# EAGLE design #100042155.3 (EAGLE 6.5.0)
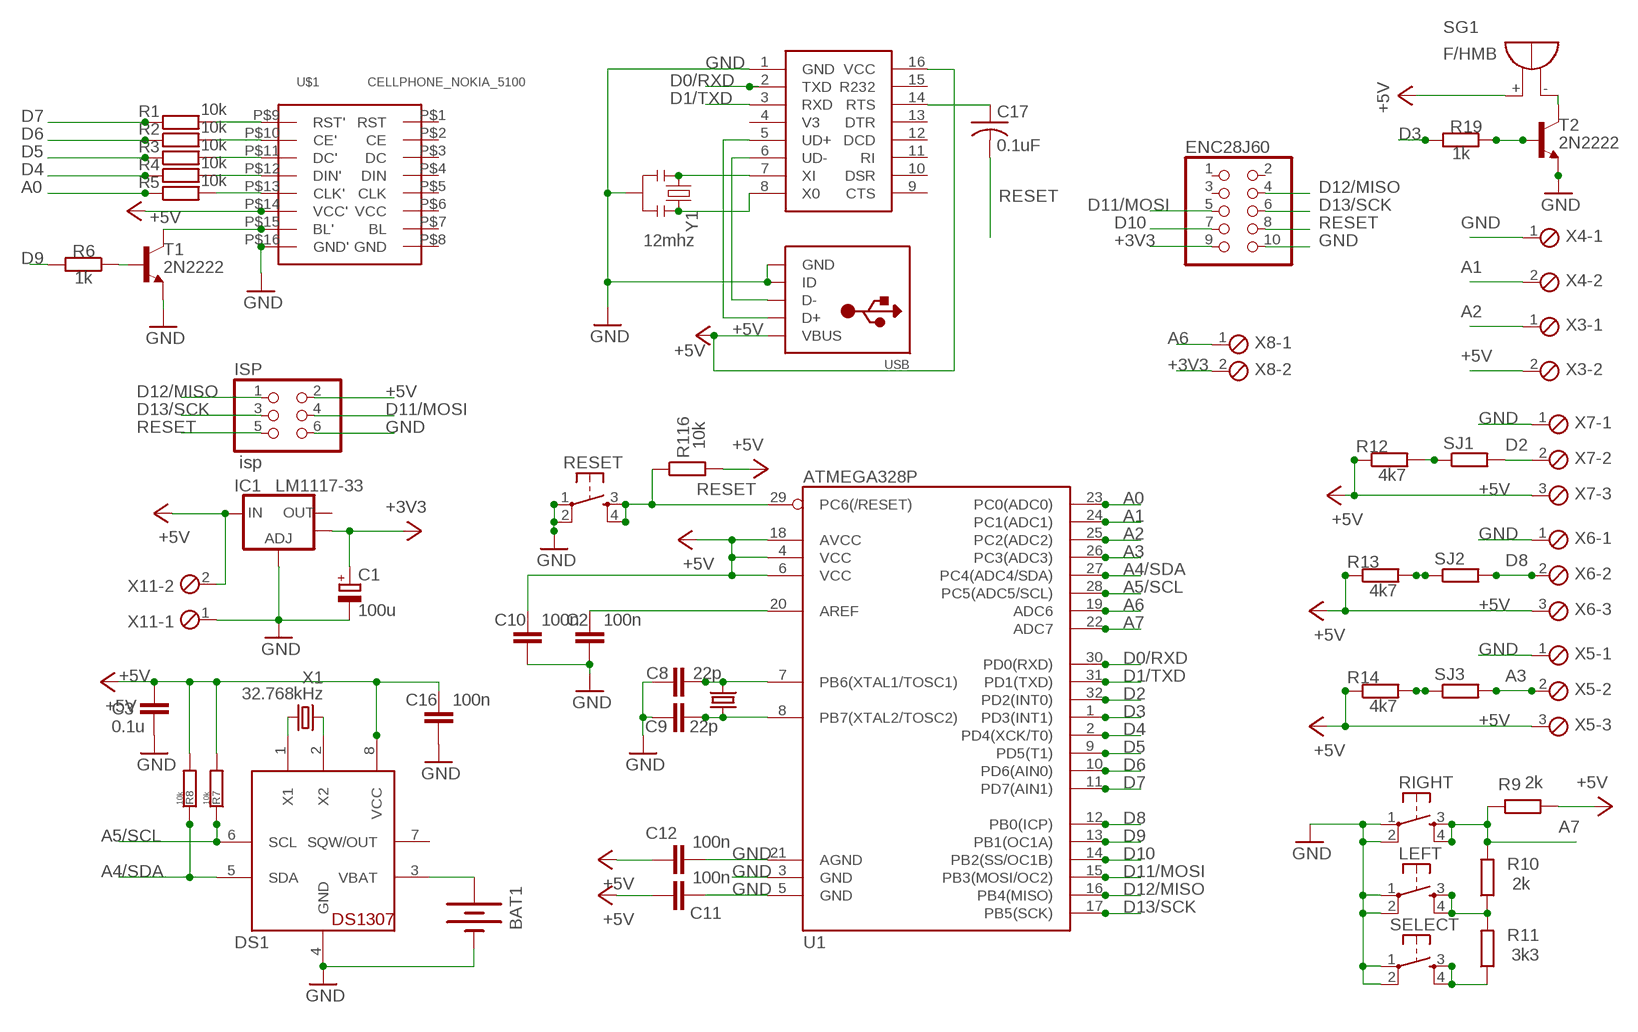
[diagram p0: schematic, sheet 1]

## Parts
BAT1  BATTERY20PTH  [BATTCOM_20MM_PTH]
C1  100u  CPOL-EUE2-5  [E2-5]
C2  100n  C-EUC0805  [C0805]
C3  0.1u  C-EUC0805  [C0805]
C8  22p  C-EUC0805  [C0805]
C9  22p  C-EUC0805  [C0805]
C10  100n  C-EUC0805  [C0805]
C11  100n  C-EUC0805  [C0805]
C12  100n  C-EUC0805  [C0805]
C16  100n  C-EUC0805  [C0805]
C17  0.1uF  C-USC0805K  [C0805K]
DS1  DS1307  DS1307SOIC  [SO08]
ENC28J60  PINHD-2X5  [2X05]
IC1  LM1117-33  V_REG_LM1117SOT223  [SOT223]
ISP  isp  PINHD-2X3  [2X03]
LEFT  TAC_SWITCHPTH  [TACTILE-PTH]
R1  10k  R-EU_R0805  [R0805]
R2  10k  R-EU_R0805  [R0805]
R3  10k  R-EU_R0805  [R0805]
R4  10k  R-EU_R0805  [R0805]
R5  10k  R-EU_R0805  [R0805]
R6  1k  R-EU_R0805  [R0805]
R7  10k  R-EU_R0805  [R0805]
R8  10k  R-EU_R0805  [R0805]
R9  2k  R-EU_R0805  [R0805]
R10  2k  R-EU_R0805  [R0805]
R11  3k3  R-EU_R0805  [R0805]
R12  4k7  R-EU_R0805  [R0805]
R13  4k7  R-EU_R0805  [R0805]
R14  4k7  R-EU_R0805  [R0805]
R19  1k  R-EU_R0805  [R0805]
R116  10k  R-EU_R0805  [R0805]
RESET  TAC_SWITCHPTH  [TACTILE-PTH]
RIGHT  TAC_SWITCHPTH  [TACTILE-PTH]
SELECT  TAC_SWITCHPTH  [TACTILE-PTH]
SG1  F/HMB  [F/HMB]
SJ1  R-EU_R0402  [R0402]
SJ2  R-EU_R0402  [R0402]
SJ3  R-EU_R0402  [R0402]
T1  2N2222  [TO92-EBC-OVAL]
T2  2N2222  [TO92-EBC-OVAL]
U1  ATMEGA328P  ATMEGA328_SMT  [TQFP32-08]
U$1  CELLPHONE_NOKIA_5100  [CELLPHONE_NOKIA_5100_SPARKFUN]
U$2  CH340G  [SO016]
USB  USBMOLEX  [USB-MINIB-THM-MOLEX]
X1  32.768kHz  CRYSTALTC26H  [TC26H]
X2  16MHz  CRYSTALHC49US  [HC49US]
X3  MPT2  [2POL254]
X4  MPT2  [2POL254]
X5  MPT3  [3POL254]
X6  MPT3  [3POL254]
X7  MPT3  [3POL254]
X8  MPT2  [2POL254]
X11  MPT2  [2POL254]
Y1  12mhz  RESONATORPTH  [RESONATOR-PTH]

## Nets
+3V3: C1.+ ENC28J60.9 IC1.4(OUT) X8.2
+5V: C3.1 C10.1 C11.2 C12.2 C16.1 DS1.8(VCC) IC1.3(IN) ISP.2 R7.2 R8.2 R9.2 R12.1 R13.1 R14.1 R116.2 SG1.+ U1.4(VCC) U1.6(VCC) U1.18(AVCC) U$1.P$14(VCC') U$2.16(VCC) USB.VBUS X3.2 X5.3 X6.3 X7.3 X11.2
A0: R5.1 U1.23(PC0(ADC0))
A1: U1.24(PC1(ADC1)) X4.2
A2: U1.25(PC2(ADC2)) X3.1
A3: SJ3.2 U1.26(PC3(ADC3)) X5.2
A4/SDA: DS1.5(SDA) R8.1 U1.27(PC4(ADC4/SDA))
A5/SCL: DS1.6(SCL) R7.1 U1.28(PC5(ADC5/SCL))
A6: U1.19(ADC6) X8.1
A7: R9.1 R10.2 RIGHT.3 RIGHT.4 U1.22(ADC7)
AREF: C2.1 U1.20(AREF)
D0/RXD: U1.30(PD0(RXD)) U$2.2(TXD)
D1/TXD: U1.31(PD1(TXD)) U$2.3(RXD)
D2: SJ1.2 U1.32(PD2(INT0)) X7.2
D3: R19.2 U1.1(PD3(INT1))
D4: R4.1 U1.2(PD4(XCK/T0))
D5: R3.1 U1.9(PD5(T1))
D6: R2.1 U1.10(PD6(AIN0))
D7: R1.1 U1.11(PD7(AIN1))
D8: SJ2.2 U1.12(PB0(ICP)) X6.2
D9: R6.2 U1.13(PB1(OC1A))
D10: ENC28J60.7 U1.14(PB2(SS/OC1B))
D11/MOSI: ENC28J60.5 ISP.4 U1.15(PB3(MOSI/OC2))
D12/MISO: ENC28J60.4 ISP.1 U1.16(PB4(MISO))
D13/SCK: ENC28J60.6 ISP.3 U1.17(PB5(SCK))
GND: BAT1.2(-) C1.- C2.2 C3.2 C8.1 C9.1 C10.2 C11.1 C12.1 C16.2 DS1.4(GND) ENC28J60.10 IC1.1(ADJ) ISP.6 LEFT.1 LEFT.2 RESET.1 RESET.2 RIGHT.1 RIGHT.2 SELECT.1 SELECT.2 T1.E T2.E U1.3(GND) U1.5(GND) U1.21(AGND) U$1.P$16(GND') U$2.1(GND) USB.GND USB.ID X4.1 X5.1 X6.1 X7.1 X11.1 Y1.2
N$1: LEFT.3 LEFT.4 R10.1 R11.2
N$2: R5.2 U$1.P$13(CLK')
N$3: R4.2 U$1.P$12(DIN')
N$4: R3.2 U$1.P$11(DC')
N$5: R2.2 U$1.P$10(CE')
N$6: R1.2 U$1.P$9(RST')
N$7: BAT1.1(+) DS1.3(VBAT)
N$8: DS1.1(X1) X1.2
N$10: U$2.7(XI) Y1.1
N$11: U$2.6(UD-) USB.D-
N$15: U$2.5(UD+) USB.D+
N$17: R13.2 SJ2.1
N$18: R11.1 SELECT.3 SELECT.4
N$26 [signal]: T1.C U$1.P$15(BL')
N$27: R19.1 T2.B
N$28: R14.2 SJ3.1
N$29: SG1.- T2.C
N$30: DS1.2(X2) X1.1
N$31: R12.2 SJ1.1
N$32: C9.2 U1.8(PB7(XTAL2/TOSC2)) X2.1
N$33: C8.2 U1.7(PB6(XTAL1/TOSC1)) X2.2
N$40: U$2.8(X0) Y1.3
N$43: C17.1 U$2.14(RTS)
N$44: R6.1 T1.B
RESET: C17.2 ENC28J60.8 ISP.5 R116.1 RESET.3 RESET.4 U1.29(PC6(/RESET))
Unconnected: DS1.7(SQW/OUT) ENC28J60.1 ENC28J60.2 ENC28J60.3 IC1.2(OUT) U$1.P$1(RST) U$1.P$2(CE) U$1.P$3(DC) U$1.P$4(DIN) U$1.P$5(CLK) U$1.P$6(VCC) U$1.P$7(BL) U$1.P$8(GND) U$2.4(V3) U$2.9(CTS) U$2.10(DSR) U$2.11(RI) U$2.12(DCD) U$2.13(DTR) U$2.15(R232)

## Library data of the parts
BAT1 = SparkFun-Electromechanical:BATTERY: Battery Holders Various common sizes : AA, AAA, 20mm coin cell and 12mm coin cell. 20MM_4LEGS, BATT-10373
C1 = resistor:CPOL-EU: POLARIZED CAPACITOR, European symbol
C2 C8-C12 C16 = resistor:C-EU: CAPACITOR, European symbol
C3 = rcl:C-EU: CAPACITOR, European symbol
C17 = rcl:C-US: CAPACITOR, American symbol
DS1 = adafruit:DS1307: DS1307 Real time clock (RTC) with battery backup ability. Talk to it via i2c
ENC28J60 = pinhead:PINHD-2X5: PIN HEADER
IC1 = SparkFun:V_REG_LM1117: Voltage Regulator LM1117 Standard adjustable voltage regulator but in SMD form. Spark Fun Electronics SKU : COM-00595
ISP = pinhead:PINHD-2X3: PIN HEADER
LEFT RESET RIGHT SELECT = SparkFun-Electromechanical:TAC_SWITCH: Momentary Switch Button commonly used for reset or general input. Spark Fun Electronics SKU : COM-00097 SMT- SWCH-08247
R1-R14 R19 R116 SJ1-SJ3 = rcl:R-EU_: RESISTOR, European symbol
SG1 = buzzer:F/HMB: BUZZER Source: Buerklin; OC_FARNELL: unknown; OC_NEWARK: unknown
T1 T2 = adafruit:2N2222: NPN TRANSISTOR Big oval pads
U1 = SparkFun-DigitalIC:ATMEGA328_SMT: 32-Pin Atmega328 part Commonly used on Arduino compatible boards Available in QFP and QFN packages TQFP is IC-09069 QFN is non-stock; PROD_ID: IC-09069
U$1 = DIY-Cellphone:CELLPHONE_NOKIA_5100
U$2 = ch340:CH340G: CH340G
USB = adafruit:USB: USB Connectors USBMINIB - Surface Mount Female Mini-B USB Connector 4UConnector: 06564 By microbuilder.eu Thru-hole RA Female Mini-B USB Connector 4UConnector: 18732 By ladyada.net
X1 = crystal:CRYSTAL: CRYSTAL; OC_FARNELL: unknown; OC_NEWARK: unknown
X2 = SparkFun:CRYSTAL: Crystals Various standard crystals. Proven footprints. Spark Fun Electronics SKU : COM-00534
X3 X4 X8 X11 = con-phoenix-254:MPT2: PHOENIX CONNECTOR; OC_FARNELL: unknown; OC_NEWARK: unknown
X5-X7 = con-phoenix-254:MPT3: PHOENIX CONNECTOR; OC_FARNELL: unknown; OC_NEWARK: unknown
Y1 = SparkFun-FreqCtrl:RESONATOR: Resonator Small SMD resonator. Used, eg, on the Arduino Pro/ Pro Mini boards. 8MHz- XTAL-08895 16MHz- XTAL-08900

## Net classes
0 default: width 0.178 mm, clearance 0.205 mm
1 power: width 0.203 mm, clearance 0.203 mm
2 GND: width 0.203 mm
3 signal: width 0.178 mm, clearance 0.205 mm to class 0, clearance 0.205 mm to class 1, clearance 0.205 mm to class 2, clearance 0.205 mm

## Board
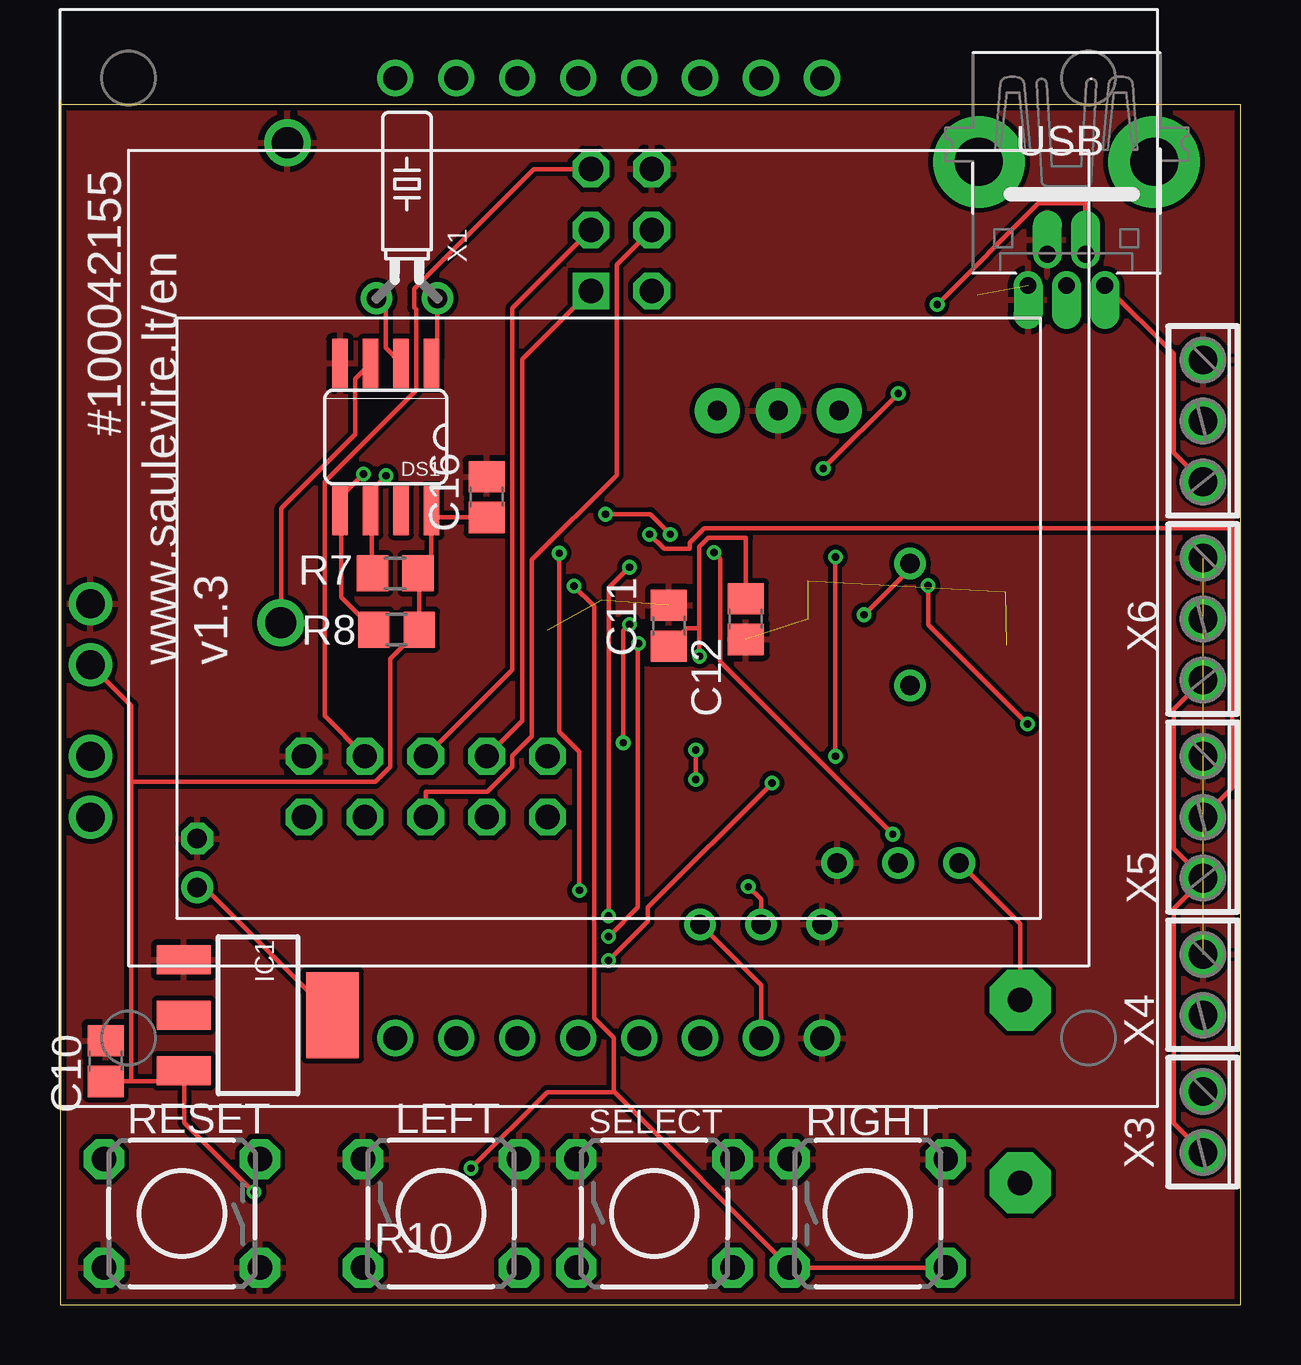
[diagram p1: board, top side]
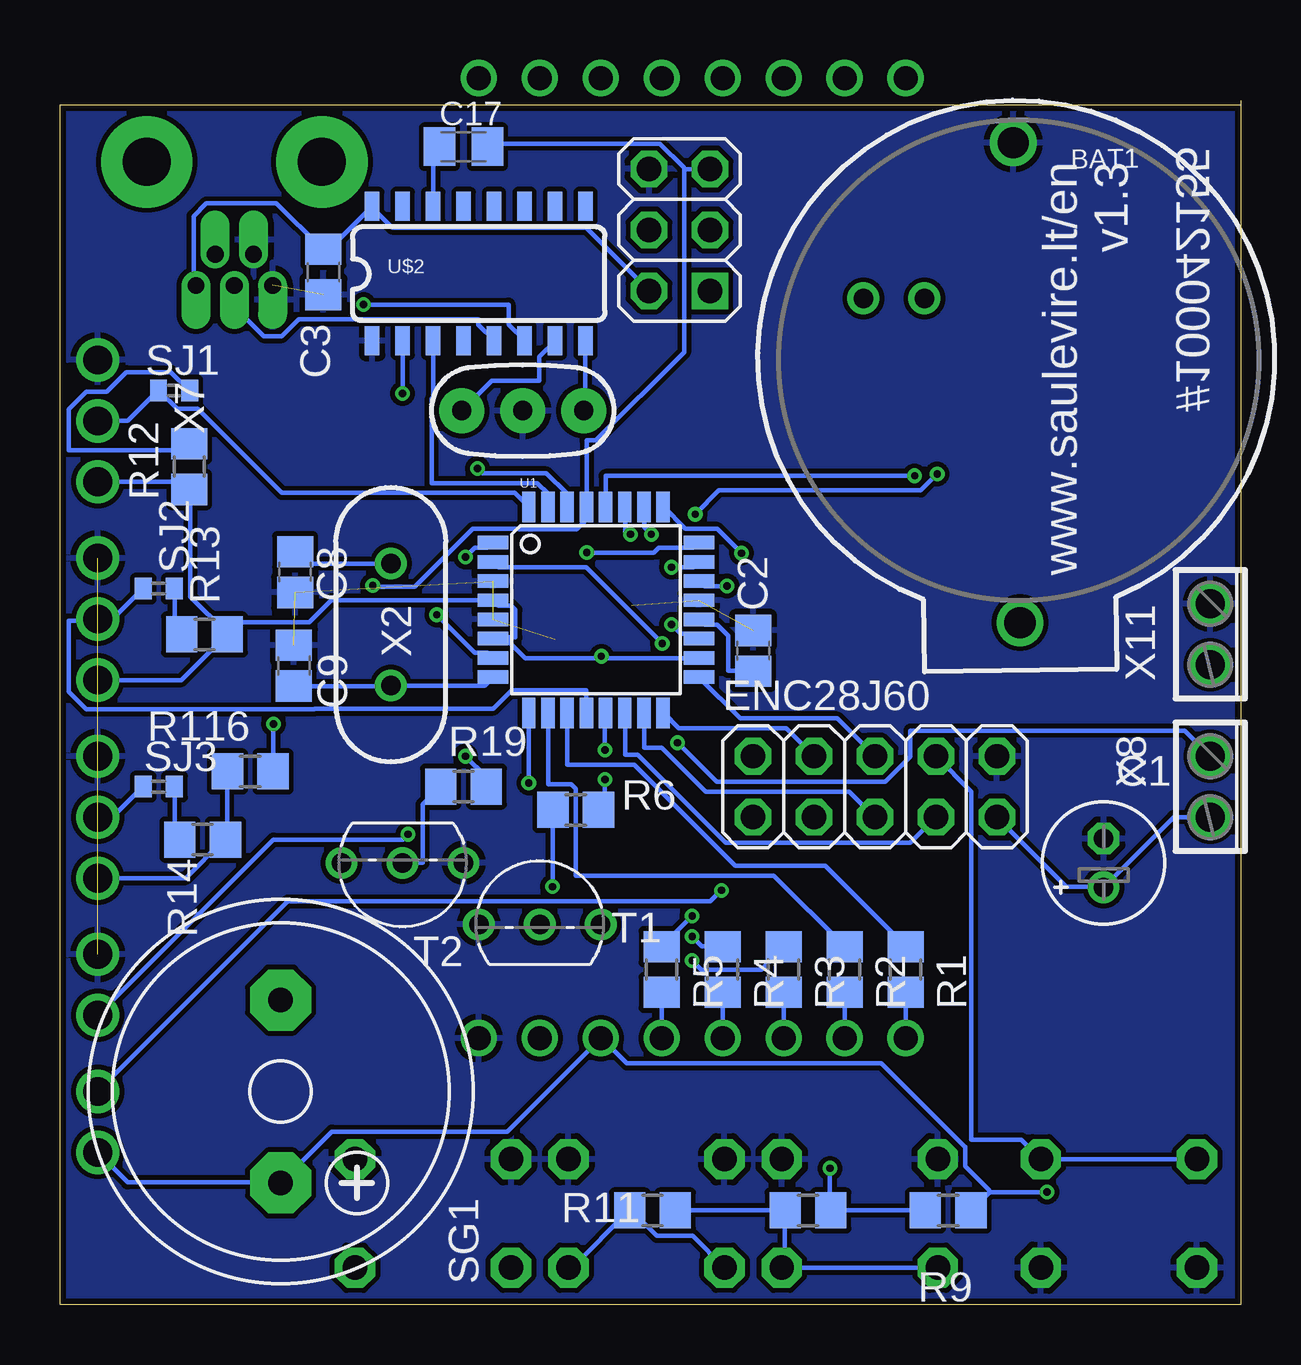
[diagram p2: board, bottom side, seen from below]

Size 49.2 x 50.16 mm. Coordinates in mm from the lower left corner, seen from the top.
Outline: 0,50 49.2,50 49.2,0 0,0 0,50.16
Copper layers (1*16): Top 0.035mm / dielectric 1.5mm / Bottom 0.035mm
Design rules "ITEADstudio_DRC": minimum track width 6mil, minimum drill 12mil, track to track 6mil, track to pad 6mil, pad to pad 6mil, via to via 6mil, smd to smd 0mil, copper to edge 10mil, drill to drill 10mil, minimum pad ring 10mil, minimum via ring 6mil, stop-mask expansion 2mil, vias tented up to drill 100mil, thermal gap 10mil
vRestrict: area 32,73 to 71,78

### Footprints (pad centres in the part's own frame; a part is rotated, then mirrored left to right if it is on the bottom)
BATTCOM_20MM_PTH = drill 1.3: 1 20,0; 2 0,0
E2-5 = drill 0.813 pad 1.27: + -1.016,0 | drill 0.813 pad 1.27 octagon: - 1.016,0
C0805 = smd 1.3 x 1.5: 1 -0.85,0; 2 0.85,0
C0805' = smd 1.3 x 1.5: 1 -0.95,0; 2 0.95,0
C0805K = smd 1.3 x 1.6: 1 -1,0; 2 1,0
SO08 = smd 0.66 x 2.032: 1 -1.905,-3.073; 2 -0.635,-3.073; 3 0.635,-3.073; 4 1.905,-3.073; 5 1.905,3.073; 6 0.635,3.073; 7 -0.635,3.073; 8 -1.905,3.073
2X05 = drill 1.016 octagon: 1 -5.08,-1.27; 2 -5.08,1.27; 3 -2.54,-1.27; 4 -2.54,1.27; 5 0,-1.27; 6 0,1.27; 7 2.54,-1.27; 8 2.54,1.27; 9 5.08,-1.27; 10 5.08,1.27
SOT223 = smd 1.219 x 2.235: 1 -2.311,-3.099; 2 0,-3.099; 3 2.311,-3.099 | smd 3.6 x 2.2: 4 0,3.099
2X03 = drill 1.016 square: 1 -2.54,-1.27 | drill 1.016 octagon: 2 -2.54,1.27; 3 0,-1.27; 4 0,1.27; 5 2.54,-1.27; 6 2.54,1.27
TACTILE-PTH = drill 1.016 pad 1.676 octagon: 1 -3.251,2.261; 2 3.251,2.261; 3 -3.251,-2.261; 4 3.251,-2.261
R0805 = smd 1.3 x 1.5: 1 -0.95,0; 2 0.95,0
F/HMB = drill 1.016 pad 2.54 octagon: + 3.81,0; - -3.81,0
R0402 = smd 0.7 x 0.9: 1 -0.65,0; 2 0.65,0
TO92-EBC-OVAL = drill 0.813: B 0,-1.27; C 2.54,-1.27; E -2.54,-1.27
TQFP32-08 = smd 1.27 x 0.559: 1 -4.293,2.8; 2 -4.293,2; 3 -4.293,1.2; 4 -4.293,0.4; 5 -4.293,-0.4; 6 -4.293,-1.2; 7 -4.293,-2; 8 -4.293,-2.8; 17 4.293,-2.8; 18 4.293,-2; 19 4.293,-1.2; 20 4.293,-0.4; 21 4.293,0.4; 22 4.293,1.2; 23 4.293,2; 24 4.293,2.8 | smd 0.559 x 1.27: 9 -2.8,-4.293; 10 -2,-4.293; 11 -1.2,-4.293; 12 -0.4,-4.293; 13 0.4,-4.293; 14 1.2,-4.293; 15 2,-4.293; 16 2.8,-4.293; 25 2.8,4.293; 26 2,4.293; 27 1.2,4.293; 28 0.4,4.293; 29 -0.4,4.293; 30 -1.2,4.293; 31 -2,4.293; 32 -2.8,4.293
CELLPHONE_NOKIA_5100_SPARKFUN = drill 1: P$1 -8.89,20; P$2 -6.35,20; P$3 -3.81,20; P$4 -1.27,20; P$5 1.27,20; P$6 3.81,20; P$7 6.35,20; P$8 8.89,20; P$9 -8.89,-20; P$10 -6.35,-20; P$11 -3.81,-20; P$12 -1.27,-20; P$13 1.27,-20; P$14 3.81,-20; P$15 6.35,-20; P$16 8.89,-20
SO016 = smd 0.6 x 1.2: 1 -4.445,-2.8; 2 -3.175,-2.8; 3 -1.905,-2.8; 4 -0.635,-2.8; 5 0.635,-2.8; 6 1.905,-2.8; 7 3.175,-2.8; 8 4.445,-2.8; 9 4.445,2.8; 10 3.175,2.8; 11 1.905,2.8; 12 0.635,2.8; 13 -0.635,2.8; 14 -1.905,2.8; 15 -3.175,2.8; 16 -4.445,2.8
USB-MINIB-THM-MOLEX = drill 0.7 offset: D+ 0,9.72; D- -0.8,8.42; GND 1.6,9.72; ID 0.8,8.42; VBUS -1.6,9.72 | drill 2 pad 3.81: GND1 -3.65,4.57; GND4 3.65,4.57
TC26H = drill 0.813: 1 -1.27,0; 2 1.27,0
HC49US = drill 0.813: 1 -2.54,0; 2 2.54,0
2POL254 = drill 1.2: 1 -1.27,0; 2 1.27,0
3POL254 = drill 1.2: 1 -2.54,0; 2 0,0; 3 2.54,0
RESONATOR-PTH = drill 0.8 pad 1.88: 1 -2.54,0; 2 0,0; 3 2.54,0

### Placement (x,y rotation side)
BAT1  9.48,48.42 270.8 bottom
C1  5.71,18.41 90 bottom
C2  20.32,27.25 90 bottom
C3  0.1u  [C0805']  38.22,43.04 270 bottom
C8  39.41,30.54 90 bottom
C9  39.45,26.64 270 bottom
C10  1.91,10.16 90 top
C11  25.37,28.3 270 top
C12  28.57,28.57 90 top
C16  17.78,33.66 90 top
C17  32.38,48.26 0 bottom
DS1  13.57,36.16 180 top
ENC28J60  15.24,21.59 0 bottom
IC1  8.26,12.06 270 top
ISP  23.39,44.79 90 bottom
LEFT  15.88,3.81 0 top
R1  13.97,13.97 270 bottom
R2  16.51,13.97 270 bottom
R3  19.05,13.97 270 bottom
R4  21.59,13.97 270 bottom
R5  24.13,13.97 270 bottom
R6  27.71,20.62 0 bottom
R7  13.97,30.48 0 top
R8  14.02,28.13 0 top
R9  12.19,3.94 0 bottom
R10  18.03,3.94 0 bottom
R11  24.51,3.94 0 bottom
R12  43.81,34.92 90 bottom
R13  43.18,27.94 180 bottom
R14  43.26,19.38 180 bottom
R19  32.38,21.59 0 bottom
R116  41.27,22.23 180 bottom
RESET  5.08,3.81 180 top
RIGHT  33.66,3.81 0 top
SELECT  24.77,3.81 0 top
SG1  40.01,8.89 270 bottom
SJ1  44.45,38.1 180 bottom
SJ2  45.09,29.84 180 bottom
SJ3  45.09,21.59 180 bottom
T1  29.21,17.12 0 bottom
T2  34.92,17.14 180 bottom
U1  26.87,28.96 0 bottom
U$1  22.86,31.11 0 top
U$2  31.75,42.98 0 bottom
USB  41.94,52.2 180 top
X1  14.46,41.94 0 top
X2  35.41,28.34 90 bottom
X3  47.62,7.62 270 top
X4  47.62,13.34 270 top
X5  47.62,20.32 270 top
X6  47.62,28.57 270 top
X7  47.62,36.83 270 top
X8  1.27,21.59 270 bottom
X11  1.27,27.94 270 bottom
Y1  29.92,37.26 0 bottom

### Tracks (layer width: path | path; a pad name or v marks a point on that pad's centre or on a via)
+3V3
  Top 0.178: IC1.4 6.02,17.4 C1.+ | IC1.4
  Bottom 0.178: X8.2 2.79,20.32 C1.+ 5.79,17.42 7.26,17.42 ENC28J60.9
+5V  (via drill 0.3)
  Top 0.178: C16.1 17.78,32.82 15.49,32.82 15.49,33.07 DS1.8 15.47,32.74 15.47,31.06 14.96,30.56 R7.2 14.94,30.48 14.96,30.45 14.96,28.14 R8.2 14.91,28.07 13.77,26.92 13.77,22.43 13.13,21.79 2.97,21.79 | 2.97,9.32 5.16,9.32 IC1.3 5.18,9.25 5.18,7.59 v8.08,4.7 | 2.97,9.32 1.91,9.32 C10.1 | X11.2 2.97,24.97 2.97,21.79 | 2.97,9.32 2.97,21.79 | 26.64,28.19 26.11,28.19 C11.2 | 26.64,28.19 26.64,31.6 27,31.95 28.57,31.95 C12.2 | v26.64,27.03 26.64,28.19 | X7.3 46.41,35.51 46.41,39.62 43.56,42.47 USB.VBUS | X6.3 46.41,24.82 46.41,19 X5.3 47.6,17.7 46.41,16.51 46.41,7.57 X3.2
  Bottom 0.178: 10.46,4.7 11.23,3.94 R9.2 | v8.08,4.7 10.46,4.7 | X3.2 46.38,5.11 40.08,5.11 SG1.+ 37.87,7.21 30.56,7.21 U$1.P$14 26.59,11.07 25.58,10.06 14.99,10.06 11.51,6.58 11.48,6.58 11.48,5.77 10.49,4.78 10.46,4.7 | R116.2 42.24,19.38 R14.1 42.39,19.36 43.97,17.78 X5.3 | 26.64,26.95 29.82,26.95 30.61,27.74 31.14,27.74 U1.6 30.58,27.81 30.23,27.81 30.23,28.96 30.4,29.13 30.94,29.13 31.14,29.34 U1.4 31.24,29.36 37.9,29.36 38.81,28.45 42.6,28.45 R13.1 | 26.64,26.95 U1.18 | v26.64,27.03 26.64,26.95 | X6.3 44.15,26.04 R13.1 | X7.3 44.12,34.29 43.81,33.98 R12.1 43.76,33.91 43.76,29.52 42.27,28.02 R13.1 | USB.VBUS 43.56,42.49 43.64,42.49 43.64,45.36 43.1,45.9 40.18,45.9 38.3,44.02 C3.1 38.2,43.99 37.97,43.99 U$2.16 36.17,45.7 35.36,44.88 27.28,44.88 24.66,42.27 ISP.2
A0  (via drill 0.3)
  Top 0.178: v23.72,30.73 22.86,29.87 v22.86,16.2
  Bottom 0.178: v23.72,30.73 22.78,30.73 22.58,30.94 U1.23 | v22.86,16.2 24.13,14.94 R5.1
A1  (via drill 0.3)
  Top 0.178: v27.25,31.34 27.51,31.09 27.51,26.8 v34.7,19.61
  Bottom 0.178: v27.25,31.34 24.46,31.34 24.26,31.55 22.78,31.55 U1.24 | v34.7,19.61 34.92,19.38 40.31,19.38 X4.2
A2  (via drill 0.3)
  Top 0.178: v20.8,31.32 20.8,23.88 21.64,23.04 v21.64,17.27
  Bottom 0.178: v20.8,31.32 21.82,32.33 23.14,32.33 24.05,33.25 U1.25 | v21.64,17.27 22.1,16.82 39.7,16.82 X3.1
A3  (via drill 0.3)
  Top 0.178: v24.56,32.11 25.17,31.5 26.24,31.5 26.24,31.75 26.85,32.36 48.84,32.36 48.84,21.54 X5.2
  Bottom 0.178: X5.2 47.02,20.32 45.74,21.59 SJ3.2 | v24.56,32.11 24.87,32.41 U1.26
A4/SDA  (via drill 0.3)
  Top 0.178: v25.43,32.11 24.59,32.94 v22.73,32.94 | v12.65,34.62 11.68,33.66 11.68,33.1 DS1.5 11.71,33.02 11.71,29.49 13.06,28.14 R8.1
  Bottom 0.178: v25.43,32.11 25.65,32.11 25.65,33.25 U1.27 | v22.73,32.94 21.74,33.93 13.34,33.93 v12.65,34.62
A5/SCL  (via drill 0.3)
  Top 0.178: v13.59,34.54 12.95,33.91 12.95,33.1 DS1.6 12.98,33.02 12.98,30.5 13.01,30.48 R7.1
  Bottom 0.178: v13.59,34.54 26.47,34.54 26.47,33.27 U1.28
A6  (via drill 0.3)
  Top 0.178: v23.72,28.35 23.47,28.09 v23.47,23.42
  Bottom 0.178: U1.19 22.78,27.96 23.34,27.96 v23.72,28.35 | v23.47,23.42 21.84,21.79 14.81,21.79 13.77,22.84 13.77,23.93 2.34,23.93 X8.1
A7  (via drill 0.3)
  Top 0.178: v21.41,29.95 22.25,29.11 22.25,11.94 23.06,11.12 23.06,8.89 | 23.06,8.89 RIGHT.3 RIGHT.4 | v17.12,5.69 20.3,8.87 22.99,8.87 23.06,8.89
  Bottom 0.178: R9.1 R10.2 17.12,4.01 v17.12,5.69 | v21.41,29.95 22.35,29.95 22.55,30.15 U1.22
AREF
  Bottom 0.178: U1.20 22.55,28.55 22.35,28.35 21.82,28.35 21.36,27.89 21.36,26.42 20.32,26.42 C2.1
D0/RXD  (via drill 0.3)
  Top 0.178: v31.8,34.85 v34.92,37.97
  Bottom 0.178: v34.92,37.97 U$2.2 | v31.8,34.85 31.6,34.65 28.93,34.65 28.09,33.81 28.09,33.27 U1.30
D1/TXD
  Bottom 0.178: U$2.3 33.66,37.82 33.71,37.77 33.71,34.24 29.31,34.24 28.88,33.81 28.88,33.27 U1.31
D2
  Bottom 0.178: X7.2 46.38,36.83 SJ1.2 45.03,38.05 44.32,37.34 43.46,37.34 39.95,33.83 30.25,33.83 29.69,33.27 U1.32
D3  (via drill 0.3)
  Top 0.178: v32.31,22.86 v32.31,31.17
  Bottom 0.178: v32.31,31.17 31.93,31.55 31.37,31.55 U1.1 | v32.31,22.86 31.45,22 31.45,21.59 R19.2
D4  (via drill 0.3)
  Top 0.178: v24.11,27.56 24.08,27.53 24.08,16.56 v22.86,15.34
  Bottom 0.178: v24.11,27.56 27.28,30.73 30.94,30.73 31.14,30.94 U1.2 | v22.86,15.34 22.45,14.94 21.59,14.94 R4.1
D5  (via drill 0.3)
  Top 0.178: v29.67,21.74 24.49,16.56 24.49,15.98 v22.86,14.35
  Bottom 0.178: v29.67,21.74 U1.9 | v22.86,14.35 22.48,13.97 19.99,13.97 R3.1
D6
  Bottom 0.178: U1.10 28.85,24.66 28.85,21.69 27.89,21.69 27.71,21.51 27.71,17.88 19.46,17.88 16.51,14.94 R2.1
D7
  Bottom 0.178: U1.11 28.07,22.5 25.27,22.5 21.06,18.29 17.32,18.29 13.97,14.94 R1.1
D8
  Bottom 0.178: SJ2.2 45.74,29.84 47.02,28.57 X6.2 47.65,28.5 48.84,28.5 48.84,25.55 48.11,24.82 38.61,24.82 38.58,24.84 31.14,24.84 30.38,25.6 27.28,25.6 27.28,24.69 U1.12
D9  (via drill 0.3)
  Top 0.178: v26.49,21.89 v26.49,23.11
  Bottom 0.178: v26.49,23.11 26.49,24.66 U1.13 | v26.49,21.89 26.49,20.62 R6.2
D10
  Bottom 0.178: ENC28J60.7 13.77,19.25 21.46,19.25 25.12,22.91 25.65,22.91 25.65,24.66 U1.14
D11/MOSI
  Top 0.178: ENC28J60.5 15.24,21.39 17.8,21.39 18.85,22.43 18.85,22.89 19.66,23.7 19.66,31.04 23.19,34.57 23.19,43.33 24.64,44.78 ISP.4
  Bottom 0.178: ENC28J60.5 16.31,21.39 22.3,21.39 24.13,23.22 24.87,23.22 U1.15
D12/MISO
  Top 0.178: ENC28J60.4 19.25,24.33 19.25,39.4 22.1,42.24 ISP.1
  Bottom 0.178: ENC28J60.4 18.95,24.03 23.42,24.03 24.05,24.66 U1.16
D13/SCK
  Top 0.178: ENC28J60.6 18.85,26.47 18.85,41.53 22.1,44.78 ISP.3
  Bottom 0.178: ENC28J60.6 16.82,24.43 20.85,24.43 22.55,26.14 U1.17
GND  (9 unrouted)
  pour Bottom: 0,50.16 48.9,50.16 48.9,0 0,0
  pour Top: 0.64,50.16 48.9,50.16 48.9,0 0,0 0,50.16
N$1
  Bottom 0.178: R11.2 R10.1 19,3.94 19,1.55 LEFT.4 LEFT.3
N$2
  Bottom 0.178: U$1.P$13 R5.2
N$3
  Bottom 0.178: U$1.P$12 R4.2
N$4
  Bottom 0.178: U$1.P$11 R3.2
N$5
  Bottom 0.178: U$1.P$10 R2.2
N$6
  Bottom 0.178: U$1.P$9 R1.2
N$7
  Top 0.178: DS1.3 12.93,39.22 12.29,38.58 12.29,36.27 9.22,33.2 9.22,28.45 BAT1.1
N$8
  Top 0.178: DS1.1 15.49,39.24 15.72,39.47 X1.2
N$10
  Bottom 0.178: Y1.1 31.22,38.51 29.23,38.51 29.23,39.5 28.57,40.16 U$2.7
N$11  (via drill 0.3)
  Top 0.178: v36.55,41.68 40.77,45.9 42.72,45.9 42.72,43.79 USB.D-
  Bottom 0.178: v36.55,41.68 30.5,41.68 30.5,40.84 U$2.6
N$15
  Bottom 0.178: U$2.5 31.77,40.84 31.77,41.07 39.24,41.07 39.95,40.36 40.72,40.36 41.94,41.58 USB.D+
N$17
  Bottom 0.178: R13.2 44.42,27.94 44.42,29.84 SJ2.1
N$18
  Bottom 0.178: SELECT.4 27.86,1.55 25.48,3.94 R11.1 25.38,3.91 24.33,2.87 22.84,2.87 SELECT.3
N$26
  Top 0.178: T1.C 29.21,13.31 U$1.P$15
N$27
  Bottom 0.178: T2.B 34.09,18.41 34.09,20.85 R19.1
N$28
  Bottom 0.178: R14.2 44.42,19.38 44.42,21.59 SJ3.1
N$29
  Top 0.178: T2.C 40.01,15.88 SG1.-
N$30
  Top 0.178: DS1.2 13.56,39.88 13.56,41.58 13.21,41.94 X1.1
N$31
  Bottom 0.178: SJ1.1 43.81,38.1 44.58,38.86 46.43,38.86 47.24,38.05 48.11,38.05 48.84,37.31 48.84,35.61 44.07,35.61 43.81,35.87 R12.2
N$32
  Bottom 0.178: U1.8 31.17,26.14 31.5,25.81 X2.1 35.48,25.78 C9.2
N$33  (via drill 0.3)
  Top 0.178: v33.5,28.75 35.41,30.66 35.41,30.86 X2.2
  Bottom 0.178: v33.5,28.75 31.93,27.18 31.37,27.18 31.17,26.98 U1.7 | C8.2 39.4,31.37 38.91,30.89 35.43,30.89 X2.2
N$40
  Bottom 0.178: U$2.8 27.3,37.26 Y1.3
N$43
  Bottom 0.178: U$2.14 33.66,48.26 C17.1
N$44  (via drill 0.3)
  Top 0.178: v28.68,17.42 29.21,16.89 T1.B
  Bottom 0.178: v28.68,17.42 28.68,20.62 R6.1
RESET  (via drill 0.3)
  Top 0.178: v40.31,24.21 36.17,28.35 v36.17,29.97 | ENC28J60.8 11.02,24.54 11.02,34.29 14.83,38.1 14.83,41.48 14.76,41.55 14.76,42.34 19.74,47.32 22.1,47.32 ISP.5
  Bottom 0.178: ENC28J60.8 11.23,21.39 11.23,6.88 9.14,6.88 RESET.3 RESET.4 | 23.19,47.32 23.19,39.7 26.87,36.02 27.25,36.02 27.25,33.27 U1.29 27.3,33.17 27.3,32.66 27.66,32.31 30.07,32.31 30.1,32.33 32,32.33 34.42,29.92 36.12,29.92 v36.17,29.97 | 23.19,47.32 ISP.5 | v40.31,24.21 R116.1 | C17.2 31.24,48.39 24.21,48.39 23.22,47.4 23.19,47.32

### Text on the board
tNames: #100042155 | www.saulevire.lt/en / v1.3
bNames: #100042155 | www.saulevire.lt/en / v1.3
BoxDim: Serpac WM-032C Enclosure | All units are in inch | Left | Right | Front | Bottom